# Altium schematic sheet PowerOut.SchDoc
size Letter
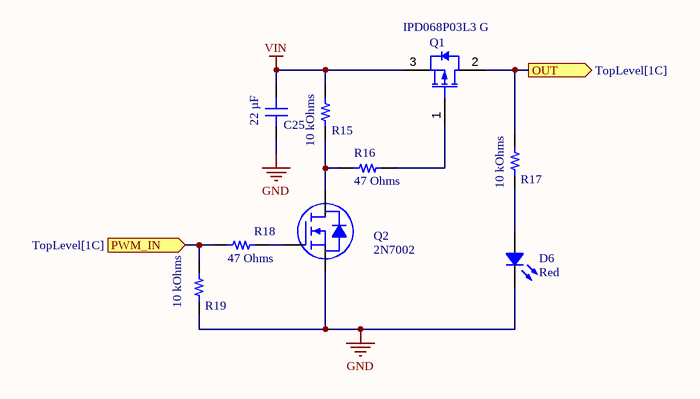
[diagram p0: PowerOut.SchDoc]

## Parts
C25  22 µF  [CAP 0805_2012]
D6  Red  [LED 0603_1608 RED]
Q1  IPD068P03L3 G  [INF-PG-TO252-3-1_M]
Q2  2N7002  [ON SEMI SOT-23-3]
R15  10 kOhms  [YAGEO RES 0603_1608]
R16  47 Ohms  [YAGEO RES 0603_1608]
R17  10 kOhms  [YAGEO RES 0603_1608]
R18  47 Ohms  [YAGEO RES 0603_1608]
R19  10 kOhms  [YAGEO RES 0603_1608]

## Ports
OUT (out, see TopLevel[1C]), PWM_IN (in, see TopLevel[1C])

## Nets
GND: C25.2 D6.2 Q2.2(S) R19.2
VIN: C25.1 Q1.3(SOURCE) R15.1
OUT: Q1.2(DRAIN) R17.1 ; port OUT
PWM_IN: R18.1 R19.1 ; port PWM_IN
NetD6_1: D6.1 R17.2
NetQ1_1: Q1.1(GATE) R16.2
NetQ2_1: Q2.1(G) R18.2
NetQ2_3: Q2.3(D) R15.2 R16.1

## Notes on the sheet
- DWG. NO.
- REV.
- SHT.
- REVISION
- DESCRIPTION
- DATE
- APPROVED
- THIS DOCUMENT AND THE DATA DISCLOSED HEREIN OR HEREWITH IS THE PROPERTY OF ALTIUM LIMITED AND MAY BE FREELY DISTRIBUTED IN WHOLE. NO RIGHTS ARE RESERVED OR EXPRESS OR IMPLIED WARANTEE GIVEN.
- ENG:
- DSN:
- APPROVALS
- PROJECT
- DOCUMENT REVISION:
- DESIGN ITEM:
- CHK:
- BOM:
- REFERENCE DOCUMENTS
- PROJECT REVISION:
- TITLE
- FAB DWG:
- PCB DWG:
- ASSY DWG:
- SCALE:
- SIZE
- C
- CAGE CODE
- FILE NAME
- DWG NO.
- SHEET
- OF
- REV

## Library data of the parts
C25 = GMC21X5R226M35NT: CAP0805 X5R 22UF 20% 35V; manufacturer: Cal-Chip Electronics, Inc.; Tolerance: ±20%; value: 22 µF; Part Number: GMC21X5R226M35NT; Applications: General Purpose; componentlink1description: Datasheet; componentlink1url: https://88ce57.p3cdn1.secureserver.net/wp-content/uploads/2023/01/gmc_series-2.pdf; componentlink2description: DigiKey Link; componentlink2url: https://www.digikey.com/en/products/detail/cal-chip-electronics-inc/GMC21X5R226M35NT/18151151; Device Package: 0805 (2012 Metric); lastupdated: 2024-02-09 20:14:42; Lifecycle Status: Active; Minimum Order: 1; Mounting Type: Surface Mount, MLCC; Operating Temperature: -55°C ~ 85°C; Package / Case: 0805 (2012 Metric); packaging: TapeAndReel; partid: 49838; Part Status: Active; price: 0.21; series: GMC; Size / Dimension: 0.079" L x 0.049" W (2.00mm x 1.25mm); Supplier 1: DigiKey; Supplier Part Number 1: 4713-GMC21X5R226M35NTCT-ND; Temperature Coefficient: X5R; Thickness (Max): 0.057" (1.45mm); Voltage - Rated: 35V
D6 = LR Q976.01-P2R2-1: LED RED CLEAR 0603 SMD; Manufacturer: ams-OSRAM USA Inc.; Current - Test: 20mA; Lens Color: Colorless; Lens Size: 1.10mm x 0.80mm; Lens Style: Rectangle with Flat Top; Millicandela Rating: 118mcd; Viewing Angle: 140°; Voltage - Forward (Vf) (Typ): 2V; Wavelength - Dominant: 623nm; Wavelength - Peak: 628nm; Part Number: LR Q976.01-P2R2-1; Color: Red; ComponentLink2Description: DigiKey Link; ComponentLink2URL: https://www.digikey.com/en/products/detail/ams-osram-usa-inc/LR-Q976-01-P2R2-1/21556490; Device Package: 0603 (1608 Metric); Height (Max): 0.75mm; LastUpdated: 2024-06-03 19:59:37; Lens Transparency: Clear; Lifecycle Status: Active; Minimum Order: 1; Mounting Type: Surface Mount; Package / Case: 0603 (1608 Metric); Packaging: TapeAndReel; PartId: 1467; Price: 0.02; Series: LO Q976.01; Size / Dimension: 1.60mm L x 0.80mm W; Supplier 1: DigiKey; Supplier Part Number 1: 475-LRQ976.01-P2R2-1CT-ND; Supplier Device Package: 0603; Value: Red
Q1 = IPD068P03L3 G: P-Channel OptiMOS P3 Power-Transistor, -30 V VDS, -70 A ID, -55 to 175 degC, PG-TO252-3-1, Reel, Green; Manufacturer: Infineon; VGS(th) (min): -1Â V; RDS (on) (max): 6.8Â mOhm; Pto t (max): 100Â W; RDS (on) (max) (@4.5V): 11Â mOhm; VGS(th) (max): -2Â V; VDS (max): -30Â V; Green: TRUE; ID (max): -70Â A; IDpuls (max): -280Â A; Rth: 1.5Â K/W; RthJC (max): 1.5 K/W; QG: 68Â nC; PartNumber: IPD068P03L3 G; ComponentLink1Description: Manufacturer URL; ComponentLink2Description: Datasheet; DatasheetVersion: Rev. 2.0; ComponentLink3URL: http://www.infineon.com/dgdl/TLE42744_DS_11.pdf?folderId=db3a304318f3fe290118f5a433570040&fileId=db3a304327b897500128012ccafe37d2&sId=db3a30443d67b5ca013d83f7c0ea327b; ComponentLink1URL: http://www.infineon.com/; Packing: Reel; ComponentLink2URL: http://www.infineon.com/dgdl/IPD068P03L3+G_2+0.pdf?folderId=db3a304314dca38901154a7313d21a66&fileId=db3a30432313ff5e01232cc234f07d94; ComponentLink3Description: Package Specification; PackageVersion: Jan-10; Mounting Technology: Surface Mount; PackageReference: PG-TO252-3-1; PackageDescription: 3-Pin Plastic (Green) Transistor Single Outline Package, 6.5 x 6.12 mm Body, 2.28 mm Pitch
Q2 = 2N7002: MOSFET N-CH 60V 115MA SOT-23; Manufacturer: ON Semiconductor; Current - Continuous Drain (Id) @ 25°C: 115mA (Ta); Drive Voltage (Max Rds On,  Min Rds On): 5V, 10V; FET Type: N-Channel; Input Capacitance (Ciss) (Max) @ Vds: 50pF @ 25V; Power Dissipation (Max): 200mW (Ta); Rds On (Max) @ Id, Vgs: 7.5Ohm @ 500mA, 10V; Vgs (Max): ±20V; Vgs(th) (Max) @ Id: 2.5V @ 250µA; ComponentLink2Description: DigiKey Link; ComponentLink1URL: https://www.onsemi.com/pub/Collateral/NDS7002A-D.PDF; ComponentLink1Description: Datasheet; ComponentLink2URL: http://digikey.com/product-detail/en/on-semiconductor/2N7002/2N7002NCT-ND/244664; Part Number: 2N7002; Drain to Source Voltage (Vdss): 60V; LastUpdated: 2024-06-03 20:15:26; Lifecycle Status: Active; Minimum Order: 1; Mounting Type: Surface Mount; Operating Temperature: -55°C ~ 150°C (TJ); Package / Case: TO-236-3, SC-59, SOT-23-3; Packaging: TapeAndReel; Part Status: Active; Price: 0.06; Series: -; Supplier 1: DigiKey; Supplier Part Number 1: 2N7002NCT-ND; Supplier Device Package: SOT-23 (TO-236AB); Technology: MOSFET (Metal Oxide)
R15 = AC0603FR-0710KL: RES SMD 10K OHM 1% 1/10W 0603; Manufacturer: Yageo; Power (Watts): 0.1W, 1/10W; Temperature Coefficient: ±100ppm/°C; Tolerance: ±1%; Value: 10 kOhms; Part Number: AC0603FR-0710KL; ComponentLink1Description: Datasheet; ComponentLink1URL: https://www.yageo.com/upload/media/product/productsearch/datasheet/rchip/PYu-AC_51_RoHS_L_7.pdf; ComponentLink2Description: DigiKey Link; ComponentLink2URL: https://www.digikey.com/en/products/detail/yageo/AC0603FR-0710KL/2827814; Composition: Thick Film; Device Package: 0603 (1608 Metric); Features: Automotive AEC-Q200, Moisture Resistant; Height - Seated (Max): 0.022" (0.55mm); LastUpdated: 2024-07-25 09:19:24; Lifecycle Status: Active; Minimum Order: 1; Number of Terminations: 2; Operating Temperature: -55°C ~ 155°C; Package / Case: 0603 (1608 Metric); Packaging: CutTape; PartId: 17347; Part Status: Active; Price: 0.01; Ratings: AEC-Q200; Resistance: 10 kOhms; Series: AC; Size / Dimension: 0.063" L x 0.031" W (1.60mm x 0.80mm); Supplier 1: DigiKey; Supplier Part Number 1: 311-10KLDCT-ND; Supplier Device Package: 0603
R16 = AC0603FR-0747RL: RES SMD 47 OHM 1% 1/10W 0603; Manufacturer: Yageo; Power (Watts): 0.1W, 1/10W; Temperature Coefficient: ±100ppm/°C; Tolerance: ±1%; Value: 47 Ohms; Part Number: AC0603FR-0747RL; ComponentLink1Description: Datasheet; ComponentLink1URL: https://www.yageo.com/upload/media/product/productsearch/datasheet/rchip/PYu-AC_51_RoHS_L_7.pdf; ComponentLink2Description: DigiKey Link; ComponentLink2URL: https://www.digikey.com/en/products/detail/yageo/AC0603FR-0747RL/2827825; Composition: Thick Film; Device Package: 0603 (1608 Metric); Features: Automotive AEC-Q200, Moisture Resistant; Height - Seated (Max): 0.022" (0.55mm); LastUpdated: 2024-07-25 09:19:23; Lifecycle Status: Active; Minimum Order: 1; Number of Terminations: 2; Operating Temperature: -55°C ~ 155°C; Package / Case: 0603 (1608 Metric); Packaging: CutTape; PartId: 17426; Part Status: Active; Price: 0.01; Ratings: AEC-Q200; Resistance: 47 Ohms; Series: AC; Size / Dimension: 0.063" L x 0.031" W (1.60mm x 0.80mm); Supplier 1: DigiKey; Supplier Part Number 1: 311-47LDCT-ND; Supplier Device Package: 0603
R17 = RV0603FR-0710KL: RES SMD 10K OHM 1% 1/10W 0603; Manufacturer: Yageo; Power (Watts): 0.1W, 1/10W; Temperature Coefficient: ±200ppm/°C; Tolerance: ±1%; Value: 10 kOhms; Part Number: RV0603FR-0710KL; ComponentLink1Description: Datasheet; ComponentLink1URL: https://www.yageo.com/upload/media/product/productsearch/datasheet/rchip/PYu-RV_51_RoHS_L_12.pdf; ComponentLink2Description: DigiKey Link; ComponentLink2URL: https://www.digikey.com/en/products/detail/yageo/RV0603FR-0710KL/5947844; Composition: Thick Film; Device Package: 0603 (1608 Metric); Features: Automotive AEC-Q200, High Voltage; Height - Seated (Max): 0.022" (0.55mm); LastUpdated: 2024-07-25 09:18:51; Lifecycle Status: Active; Minimum Order: 1; Number of Terminations: 2; Operating Temperature: -55°C ~ 155°C; Package / Case: 0603 (1608 Metric); Packaging: TapeAndReel; PartId: 86537; Price: 0.03; Ratings: AEC-Q200; Resistance: 10 kOhms; Series: RV; Size / Dimension: 0.063" L x 0.031" W (1.60mm x 0.80mm); Supplier 1: DigiKey; Supplier Part Number 1: 13-RV0603FR-0710KLCT-ND; Supplier Device Package: 0603
R18 = RC0603FR-0747RL: RES 47 OHM 1% 1/10W 0603; Manufacturer: Yageo; Power (Watts): 0.1W, 1/10W; Temperature Coefficient: ±100ppm/°C; Tolerance: ±1%; Value: 47 Ohms; Part Number: RC0603FR-0747RL; ComponentLink1Description: Datasheet; ComponentLink1URL: https://www.yageo.com/upload/media/product/productsearch/datasheet/rchip/PYu-RC_Group_51_RoHS_L_10.pdf; ComponentLink2Description: DigiKey Link; ComponentLink2URL: https://www.digikey.com/en/products/detail/yageo/RC0603FR-0747RL/727252; Composition: Thick Film; Device Package: 0603 (1608 Metric); Features: Moisture Resistant; Height - Seated (Max): 0.022" (0.55mm); LastUpdated: 2024-07-25 09:19:21; Lifecycle Status: Active; Minimum Order: 1; Number of Terminations: 2; Operating Temperature: -55°C ~ 155°C; Package / Case: 0603 (1608 Metric); Packaging: CutTape; PartId: 18960; Part Status: Active; Price: 0.01; Resistance: 47 Ohms; Series: RC_L; Size / Dimension: 0.063" L x 0.031" W (1.60mm x 0.80mm); Supplier 1: DigiKey; Supplier Part Number 1: 311-47.0HRCT-ND; Supplier Device Package: 0603
R19 = RT0603CRE0710KL: RES SMD 10K OHM 0.25% 1/10W 0603; Manufacturer: Yageo; Power (Watts): 0.1W, 1/10W; Temperature Coefficient: ±50ppm/°C; Tolerance: ±0.25%; Value: 10 kOhms; Part Number: RT0603CRE0710KL; ComponentLink1Description: Datasheet; ComponentLink1URL: https://www.yageo.com/upload/media/product/productsearch/datasheet/rchip/PYu-RT_1-to-0.01_RoHS_L_11.pdf; ComponentLink2Description: DigiKey Link; ComponentLink2URL: https://www.digikey.com/en/products/detail/yageo/RT0603CRE0710KL/1073729; Composition: Thin Film; Device Package: 0603 (1608 Metric); Height - Seated (Max): 0.022" (0.55mm); LastUpdated: 2024-07-25 09:19:25; Lifecycle Status: Active; Minimum Order: 1; Number of Terminations: 2; Operating Temperature: -55°C ~ 155°C; Package / Case: 0603 (1608 Metric); Packaging: TapeAndReel; PartId: 16408; Part Status: Active; Price: 0.04; Resistance: 10 kOhms; Series: RT; Size / Dimension: 0.063" L x 0.031" W (1.60mm x 0.80mm); Supplier 1: DigiKey; Supplier Part Number 1: YAG4794CT-ND; Supplier Device Package: 0603